# EAGLE design neopixel_arrows (EAGLE 8.6.1)
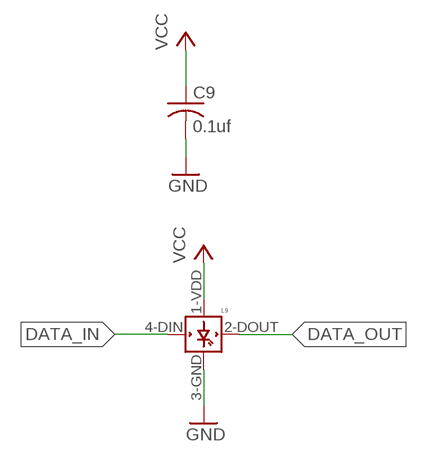
[diagram p0: schematic, sheet 1]

## Parts
C9  0.1uf  C-USC0603  [C0603]
L9  WS2812B  [WS2812B]

## Nets
DATA_IN: L9.4-DIN(DIN)
DATA_OUT: L9.2-DOUT(DOUT)
GND: C9.2 L9.3-GND(GND)
VCC: C9.1 L9.1-VDD(VDD)

## Library data of the parts
C9 = rcl:C-US: CAPACITOR, American symbol; SPICEPREFIX: C
L9 = Duly_Drive-FINAL:WS2812B; SPICEPREFIX: E

## Board
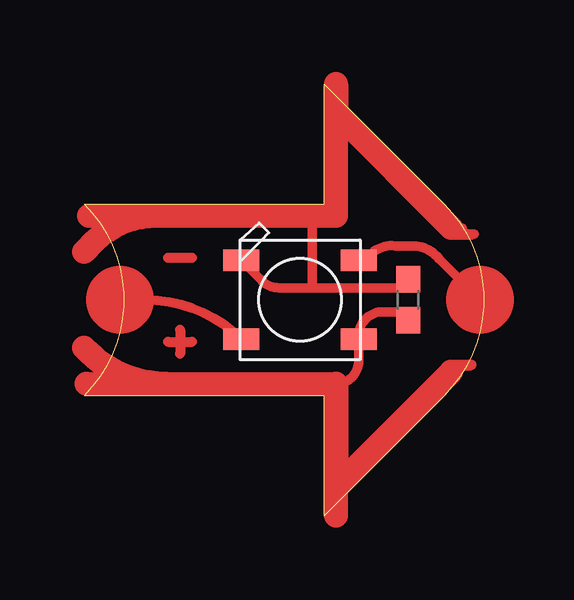
[diagram p1: board, top side]

Size 16.65 x 18 mm. Coordinates in mm from the lower left corner, seen from the top.
Outline: 0,13 10,13 10,18 15,13 arc-90 15,5 10,0 10,5 0,5 arc90 0,13
Copper layers (1*16): Top 0.035mm / dielectric 1.5mm / Bottom 0.035mm
Design rules "default": minimum track width 6mil, minimum drill 0.35mm, track to track 6mil, track to pad 6mil, pad to pad 6mil, via to via 6mil, smd to smd 6mil, copper to edge 40mil, drill to drill 6mil, minimum pad ring 10mil, minimum via ring 8mil, stop-mask expansion 4mil, vias tented up to drill 0mil, thermal gap 10mil

### Footprints (pad centres in the part's own frame; a part is rotated, then mirrored left to right if it is on the bottom)
C0603 = smd 1.1 x 1: 1 -0.85,0; 2 0.85,0
WS2812B = smd 1.5 x 0.9: 1-VDD 2.45,-1.65; 2-DOUT 2.45,1.65; 3-GND -2.45,1.65; 4-DIN -2.45,-1.65

### Placement (x,y rotation side)
C9  13.5,9 90 top
L9  9,9 0 top

### Tracks (layer width: path | path; a pad name or v marks a point on that pad's centre or on a via)
DATA_IN
  Top 0.4: L9.4-DIN arc45 2.57,9 2,9
DATA_OUT
  Top 0.4: L9.2-DOUT 12.01,10.96 arc-45 12.96,11.25 13.84,11.25 arc-45 14.79,10.71 15.75,9.75
GND
  Top 0.4: L9.3-GND 7.41,9.79 arc45 8.11,9.5 9.5,9.5 | 9.5,9.5 13.15,9.5 | 15.3,12 15.3,11.7 16.15,11.7 arc-90 16.2,11.75 | 9.5,12.5 9.5,9.5 | 16.2,11.75 16,11.75 arc-90 15.75,12 | 16.2,11.75 16.25,11.75
  Top 0.406: 6.5,10.7 L9.3-GND 6.85,10.65 | 13.15,9.5 C9.2
  Top 1: 10.5,16.8 10.5,12.5 9.5,12.5 3,12.5 | 10.5,18 10.5,16.8 | 10.5,16.8 15.3,12 | 3,12.5 0.2,12.5 | 3,12.5 arc45 0.44,11.44 0,11
N$1
  Top 0.406: 4.5,10.75 3.5,10.75
N$2
  Top 0.406: 3.5,7.25 4.5,7.25
N$3
  Top 0.406: 4,7.75 4,6.75
VCC
  Top 0.4: C9.1 13.3,8.35 arc45 12.94,8.5 12.45,8.5 arc90 11.45,7.5 L9.1-VDD 11.45,6.45 arc-90 10.5,5.5 | 15.3,6 15.3,6.3 16.15,6.3 arc-90 16.1,6.25 15.75,6.25 arc90 15.5,6
  Top 1: 10.5,1.2 10.5,5.5 3.4,5.5 | 10.5,0 10.5,1.2 | 10.5,1.2 15.3,6 | 0.1,5.5 3.4,5.5 | 3.4,5.5 arc-45 0.16,6.84 0,7
(copper drawn outside any net)
  shapes: Top circle x2